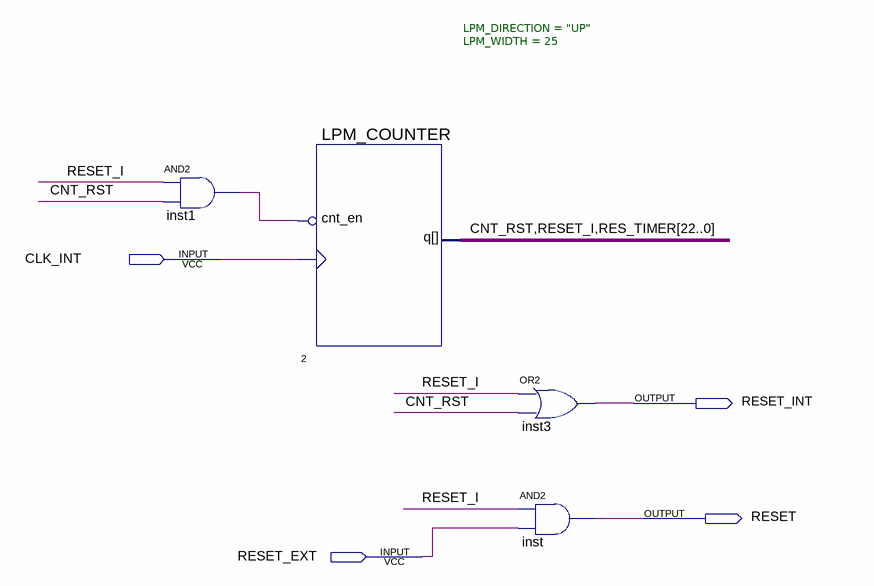
[diagram p0: schematic sheet]
// Quartus schematic mpu_reset.bdf as structural Verilog: 4 symbols, 4 pins
module mpu_reset (
  input  CLK_INT,
  input  RESET_EXT,
  output RESET_INT,
  output RESET
);

  wire CNT_RST, inst1_out, RESET_I;
  wire [22:0] RES_TIMER;

  and inst1 (inst1_out, RESET_I, CNT_RST);
  LPM_COUNTER #(.LPM_DIRECTION("UP"), .LPM_WIDTH(25)) u_2 (
    .cnt_en(~inst1_out), .clock(CLK_INT), .q({CNT_RST, RESET_I, RES_TIMER}));
  or inst3 (RESET_INT, RESET_I, CNT_RST);
  and inst (RESET, RESET_I, RESET_EXT);
endmodule
